# Altium schematic sheet top.SchDoc
size A4
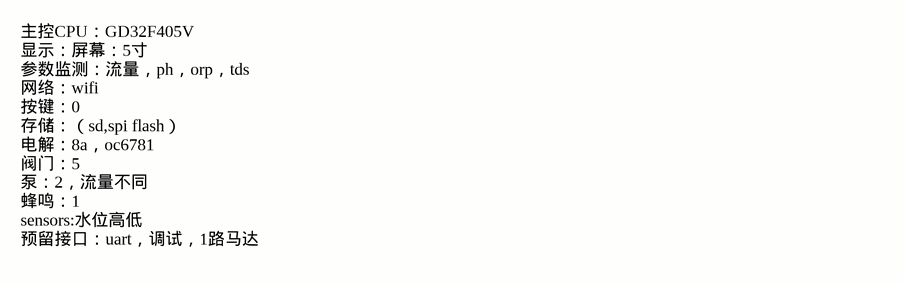
[diagram p0: top.SchDoc]

## Notes on the sheet
- 主控CPU：GD32F405V
  显示：屏幕：5寸
  参数监测：流量，ph，orp，tds
  网络：wifi
  按键：0
  存储：（sd,spi flash）
  电解：8a，oc6781
  阀门：5
  泵：2，流量不同
  蜂鸣：1
  sensors:水位高低
  预留接口：uart，调试，1路马达